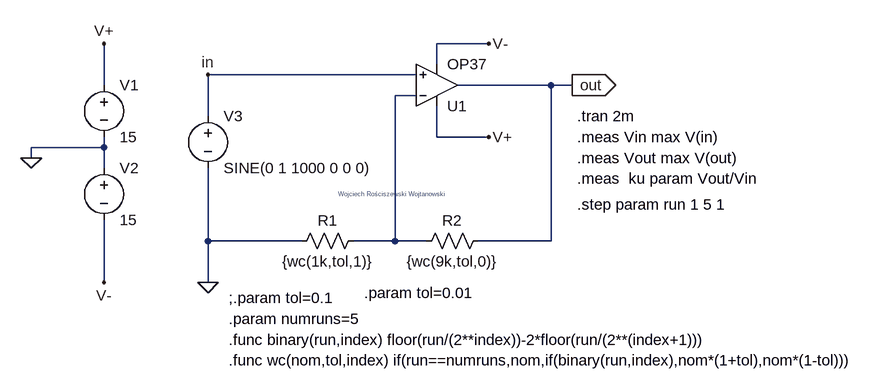
[diagram p0: schematic Amplifier Circuit WC Analysis 1.asc]
Amplifier Circuit WC Analysis 1.asc, the LTspice schematic file:
Version 4
SHEET 1 1252 936
WIRE 512 -48 432 -48
WIRE 432 -16 432 -48
WIRE 400 0 80 0
WIRE -80 16 -80 -48
WIRE 608 16 464 16
WIRE 640 16 608 16
WIRE 400 32 368 32
WIRE 80 64 80 0
WIRE 432 96 432 48
WIRE 512 96 432 96
WIRE -80 112 -80 96
WIRE -80 112 -192 112
WIRE -192 128 -192 112
WIRE -80 144 -80 112
WIRE 80 256 80 144
WIRE 224 256 80 256
WIRE 368 256 368 32
WIRE 368 256 304 256
WIRE 416 256 368 256
WIRE 608 256 608 16
WIRE 608 256 496 256
WIRE -80 320 -80 224
WIRE 80 320 80 256
FLAG -192 128 0
FLAG 80 320 0
FLAG 640 16 out
IOPIN 640 16 Out
FLAG 512 -48 V-
FLAG -80 320 V-
FLAG 512 96 V+
FLAG -80 -48 V+
FLAG 80 0 in
SYMBOL voltage -80 0 R0
WINDOW 123 0 0 Left 0
WINDOW 39 0 0 Left 0
SYMATTR InstName V1
SYMATTR Value 15
SYMBOL voltage -80 128 R0
WINDOW 123 0 0 Left 0
WINDOW 39 0 0 Left 0
SYMATTR InstName V2
SYMATTR Value 15
SYMBOL voltage 80 48 R0
WINDOW 123 0 0 Left 0
WINDOW 39 0 0 Left 0
SYMATTR InstName V3
SYMATTR Value SINE(0 1 1000 0 0 0)
SYMBOL res 320 240 R90
WINDOW 0 0 56 VBottom 2
WINDOW 3 32 56 VTop 2
SYMATTR InstName R1
SYMATTR Value {wc(1k,tol,1)}
SYMBOL res 512 240 R90
WINDOW 0 0 56 VBottom 2
WINDOW 3 32 56 VTop 2
SYMATTR InstName R2
SYMATTR Value {wc(9k,tol,0)}
SYMBOL Opamps\\OP37 432 80 M180
SYMATTR InstName U1
TEXT 280 184 Left 0 ;Wojciech Rościszewski Wojtanowski
TEXT 648 64 Left 2 !.tran 2m
TEXT 648 96 Left 2 !.meas Vin max V(in)
TEXT 648 128 Left 2 !.meas Vout max V(out)
TEXT 648 160 Left 2 !.meas  ku param Vout/Vin
TEXT 112 344 Left 2 !;.param tol=0.1
TEXT 112 376 Left 2 !.param numruns=5
TEXT 112 408 Left 2 !.func binary(run,index) floor(run/(2**index))-2*floor(run/(2**(index+1)))
TEXT 112 440 Left 2 !.func wc(nom,tol,index) if(run==numruns,nom,if(binary(run,index),nom*(1+tol),nom*(1-tol)))
TEXT 648 200 Left 2 !.step param run 1 5 1
TEXT 320 336 Left 2 !.param tol=0.01

The netlist it stands for:
* Amplifier Circuit WC Analysis 1.asc
V1 V+ 0 15
V2 0 V- 15
V3 in 0 SINE(0 1 1000 0 0 0)
R1 N001 0 {wc(1k,tol,1)}
R2 out N001 {wc(9k,tol,0)}
XU1 in N001 V+ V- out LT1037  ; OP37, pins In+ In- V+ V- OUT
* Wojciech Rościszewski Wojtanowski
.tran 2m
.meas Vin max V(in)
.meas Vout max V(out)
.meas  ku param Vout/Vin
;.param tol=0.1
.param numruns=5
.func binary(run,index) floor(run/(2**index))-2*floor(run/(2**(index+1)))
.func wc(nom,tol,index) if(run==numruns,nom,if(binary(run,index),nom*(1+tol),nom*(1-tol)))
.step param run 1 5 1
.param tol=0.01
.lib LTC.lib
.backanno
.end